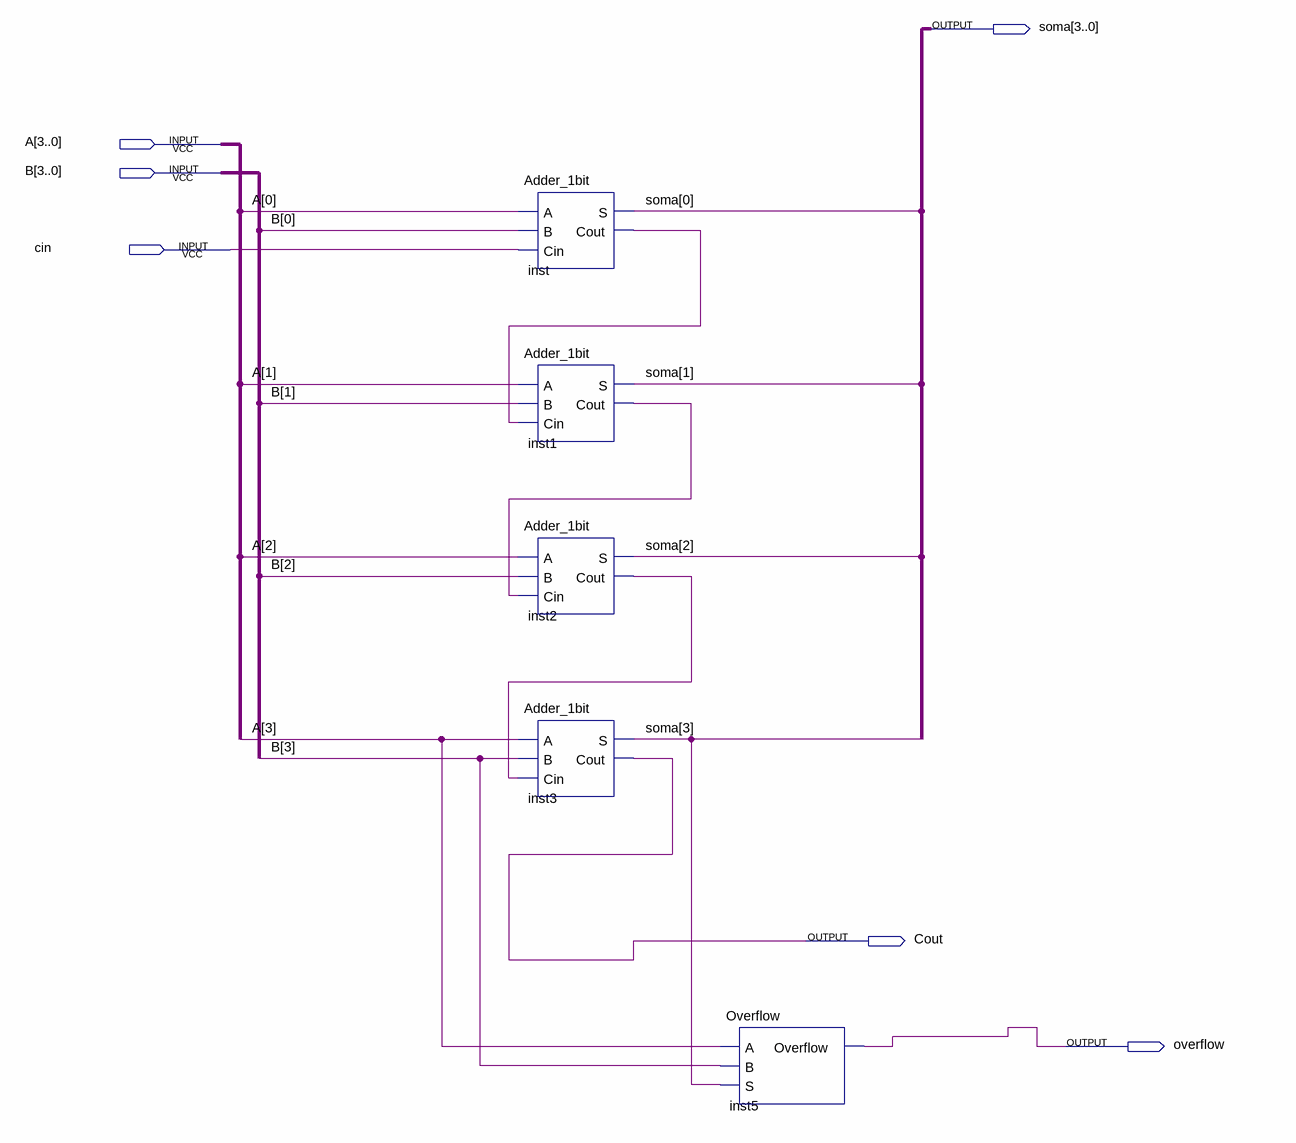
[diagram p0: schematic sheet]
// Quartus schematic Adder.bdf as structural Verilog: 5 symbols, 6 pins
module Adder (
  input  [3:0] A,
  input  [3:0] B,
  input  cin,
  output [3:0] soma,
  output Cout,
  output overflow
);

  wire inst1_cout, inst2_cout, inst_cout;

  Adder_1bit inst (.A(A[0]), .B(B[0]), .Cin(cin), .S(soma[0]), .Cout(inst_cout));
  Adder_1bit inst1 (.A(A[1]), .B(B[1]), .Cin(inst_cout), .S(soma[1]), .Cout(inst1_cout));
  Adder_1bit inst2 (.A(A[2]), .B(B[2]), .Cin(inst1_cout), .S(soma[2]), .Cout(inst2_cout));
  Adder_1bit inst3 (.A(A[3]), .B(B[3]), .Cin(inst2_cout), .S(soma[3]), .Cout(Cout));
  Overflow inst5 (.A(A[3]), .B(B[3]), .S(soma[3]), .Overflow(overflow));
endmodule
